# EAGLE design untitled-1.0 (EAGLE 9.6.2)
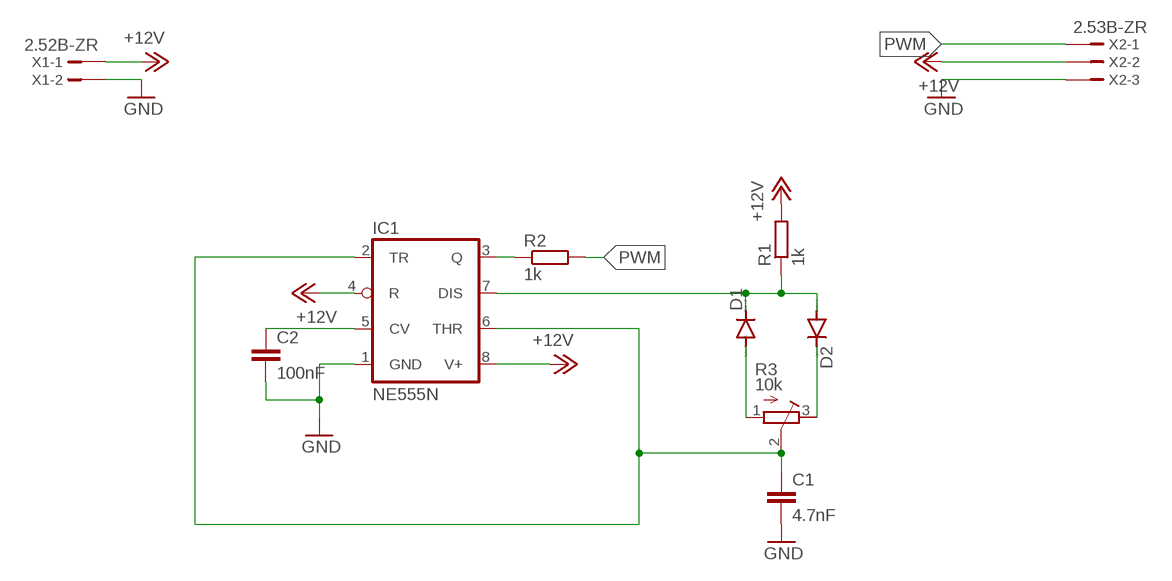
[diagram p0: schematic, sheet 1]

## Parts
C1  4.7nF  C-EU050-030X075  [C050-030X075]
C2  100nF  C-EU025-025X050  [C025-025X050]
D1  1N40045  [DO41-5]
D2  1N40045  [DO41-5]
IC1  NE555N  [DIL08]
R1  1k  R-EU_0204/7  [0204/7]
R2  1k  R-EU_0204/7  [0204/7]
R3  10k  R-TRIMM3296W  [RTRIM3296W]
X1  2.52B-ZR  [B2B-ZR2.5]
X2  2.53B-ZR  [B3B-ZR2.5]

## Nets
+12V: IC1.4(R) IC1.8(V+) R1.2 X1.1 X2.2
CV: C2.1 IC1.5(CV)
DIS: D1.C D2.A IC1.7(DIS) R1.1
GND: C1.2 C2.2 IC1.1(GND) X1.2 X2.3
N$4: D1.A R3.1(A)
N$5: D2.C R3.3(E)
PWM: R2.2 X2.1
Q: IC1.3(Q) R2.1
TR: C1.1 IC1.2(TR) IC1.6(THR) R3.2(S)

## Library data of the parts
C1 C2 = rcl-custom:C-EU: CAPACITOR, European symbol; SPICEPREFIX: C
D1 D2 = diode-custom:1N4004: DIODE general purpose rectifier, 1 A
IC1 = linear:*555: TIMER
R1 R2 = rcl-custom:R-EU_: RESISTOR, European symbol; SPICEPREFIX: R
R3 = rcl-custom:R-TRIMM: Trimm resistor; SPICEMODEL: X; SPICEPREFIXL: POT
X1 = con-jst-custom:?2B-ZR: ZH CONNECTOR 1.5 mm, 4 pin 1 row Source: http://www.jst.com .. eZH.pdf
X2 = con-jst-custom:?3B-ZR: ZH CONNECTOR 1.5 mm, 4 pin 1 row Source: http://www.jst.com .. eZH.pdf

## Board
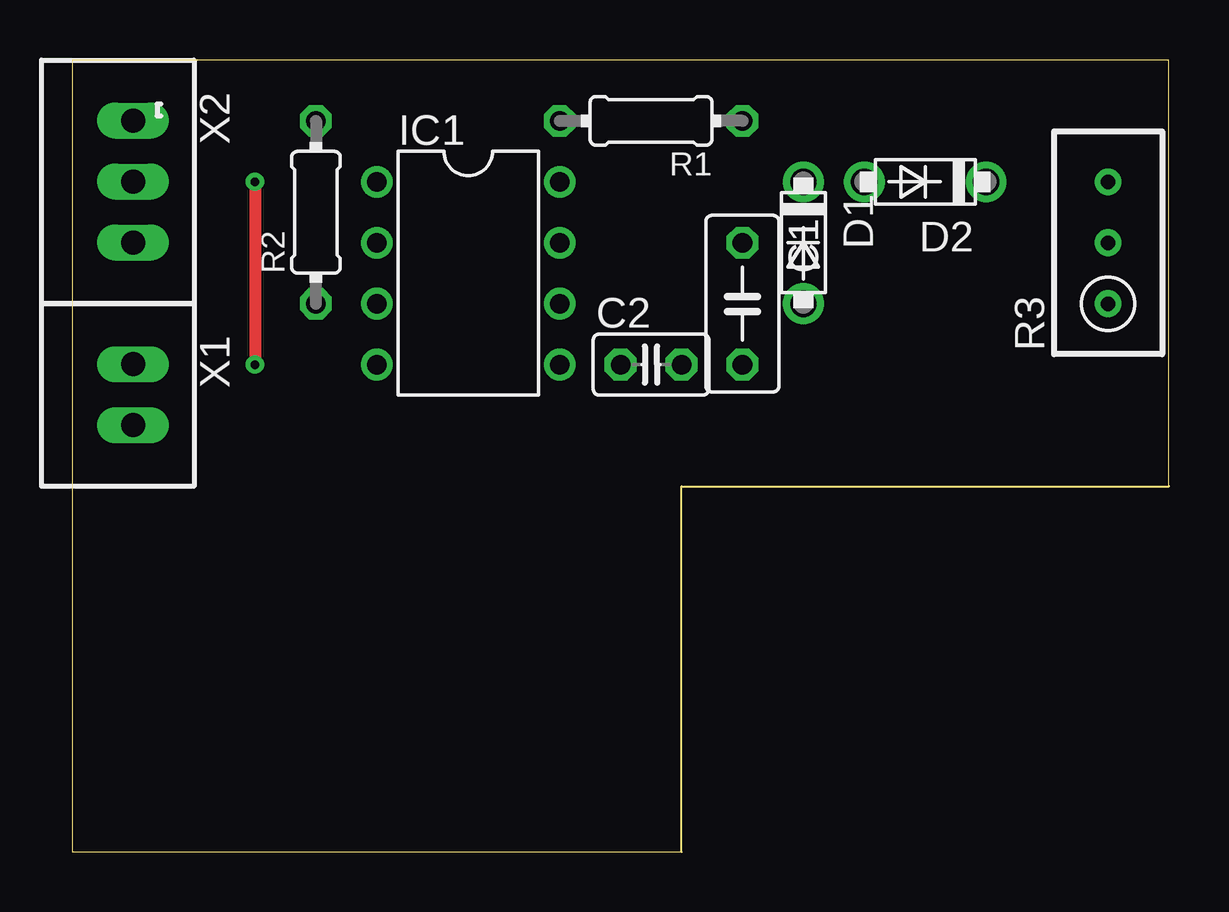
[diagram p1: board, top side]
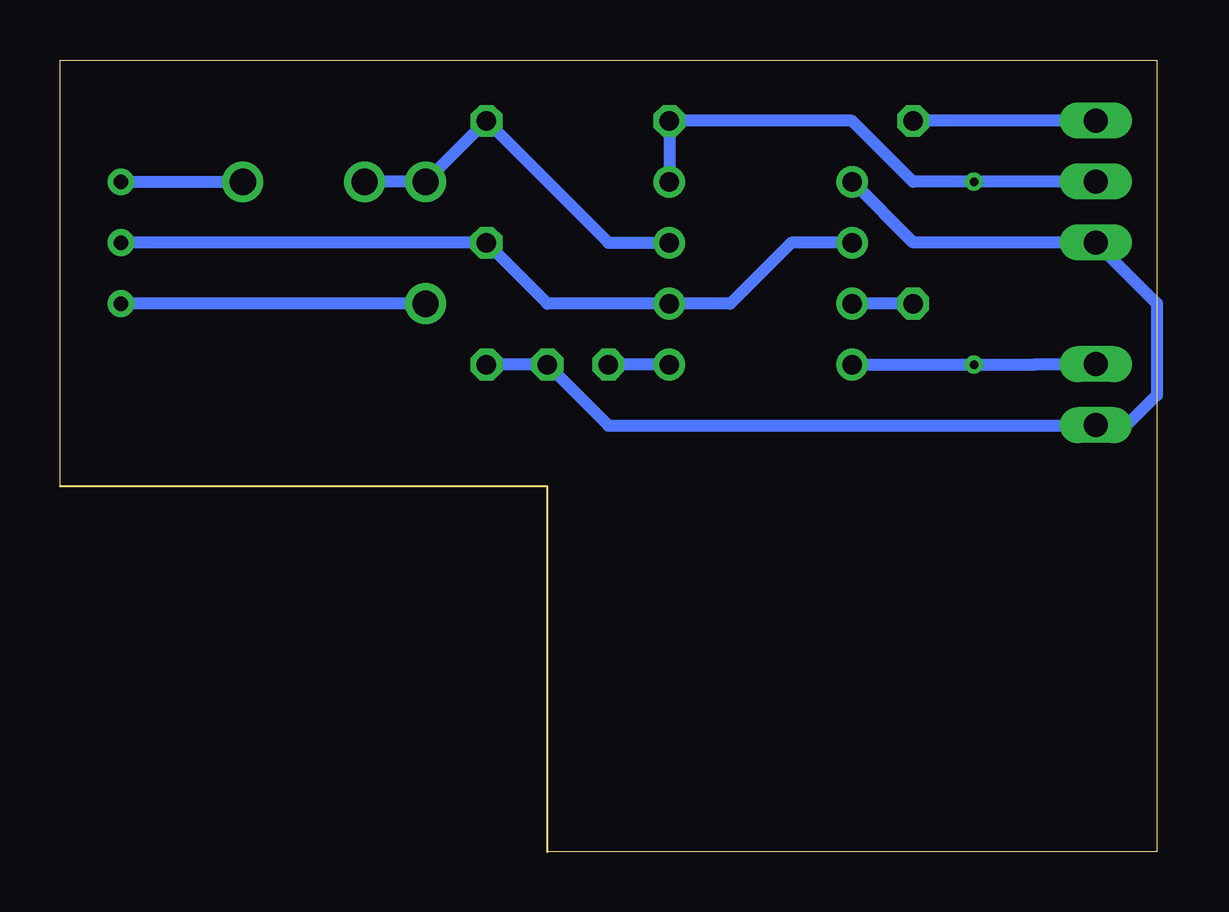
[diagram p2: board, bottom side, seen from below]

Size 45.72 x 33.02 mm. Coordinates in mm from the lower left corner, seen from the top.
Outline: 0,0 25.4,0 25.4,15.24 45.72,15.24 45.72,33.02 0,33.02 0,0
Copper layers (1*16): Top 0.035mm / dielectric 1.5mm / Bottom 0.035mm
Design rules "default": minimum track width 6mil, minimum drill 0.35mm, track to track 6mil, track to pad 6mil, pad to pad 6mil, via to via 6mil, smd to smd 6mil, copper to edge 40mil, drill to drill 6mil, minimum pad ring 10mil, minimum via ring 8mil, stop-mask expansion 4mil, vias tented up to drill 0mil, thermal gap 10mil

### Footprints (pad centres in the part's own frame; a part is rotated, then mirrored left to right if it is on the bottom)
C050-030X075 = drill 0.813 octagon: 1 -2.54,0; 2 2.54,0
C025-025X050 = drill 0.813 octagon: 1 -1.27,0; 2 1.27,0
DO41-5 = drill 1.1 pad 1.7: A 2.54,0; C -2.54,0
DIL08 = drill 0.813 pad 1.27: 1 -3.81,-3.81; 2 -1.27,-3.81; 3 1.27,-3.81; 4 3.81,-3.81; 5 3.81,3.81; 6 1.27,3.81; 7 -1.27,3.81; 8 -3.81,3.81
0204/7 = drill 0.813 octagon: 1 -3.81,0; 2 3.81,0
RTRIM3296W = drill 0.61: 1 0,-2.54; 2 0,0; 3 0,2.54
B2B-ZR2.5 = drill 1 pad 1.422 long: 1 -1.285,0; 2 1.257,0
B3B-ZR2.5 = drill 1 pad 1.422 long: 1 -2.555,0; 2 -0.013,0; 3 2.527,0

### Placement (x,y rotation side)
C1  27.94,22.86 270 top
C2  24.13,20.32 0 top
D1  30.48,25.4 270 top
D2  35.56,27.94 180 top
IC1  16.51,24.13 270 top
R1  24.13,30.48 180 top
R2  10.16,26.67 90 top
R3  43.18,25.4 0 top
X1  2.54,19.05 270 top
X2  2.54,27.94 270 top

### Tracks (layer width: path | path; a pad name or v marks a point on that pad's centre or on a via)
+12V  (via drill 0.35)
  Top 0.508: v7.62,27.94 v7.62,20.32
  Bottom 0.508: X2.2 2.55,27.94 v7.62,27.94 10.16,27.94 12.7,30.48 R1.2 IC1.8 | X1.1 5.08,20.34 5.09,20.32 v7.62,20.32 IC1.4
CV
  Bottom 0.508: IC1.5 C2.1
DIS
  Bottom 0.508: IC1.7 22.86,25.4 R1.1 D1.C D2.A
GND
  Bottom 0.508: IC1.1 12.69,27.94 10.16,25.41 X2.3 0,22.87 0,19.05 1.26,17.79 X1.2 2.55,17.78 22.86,17.78 C2.2 C1.2
N$4
  Bottom 0.508: D1.A R3.1
N$5
  Bottom 0.508: R3.3 D2.C
PWM
  Bottom 0.508: X2.1 2.56,30.48 R2.2
Q
  Bottom 0.508: R2.1 IC1.3
TR
  Bottom 0.508: IC1.2 15.24,25.4 17.78,22.86 IC1.6 25.4,22.86 C1.1 R3.2